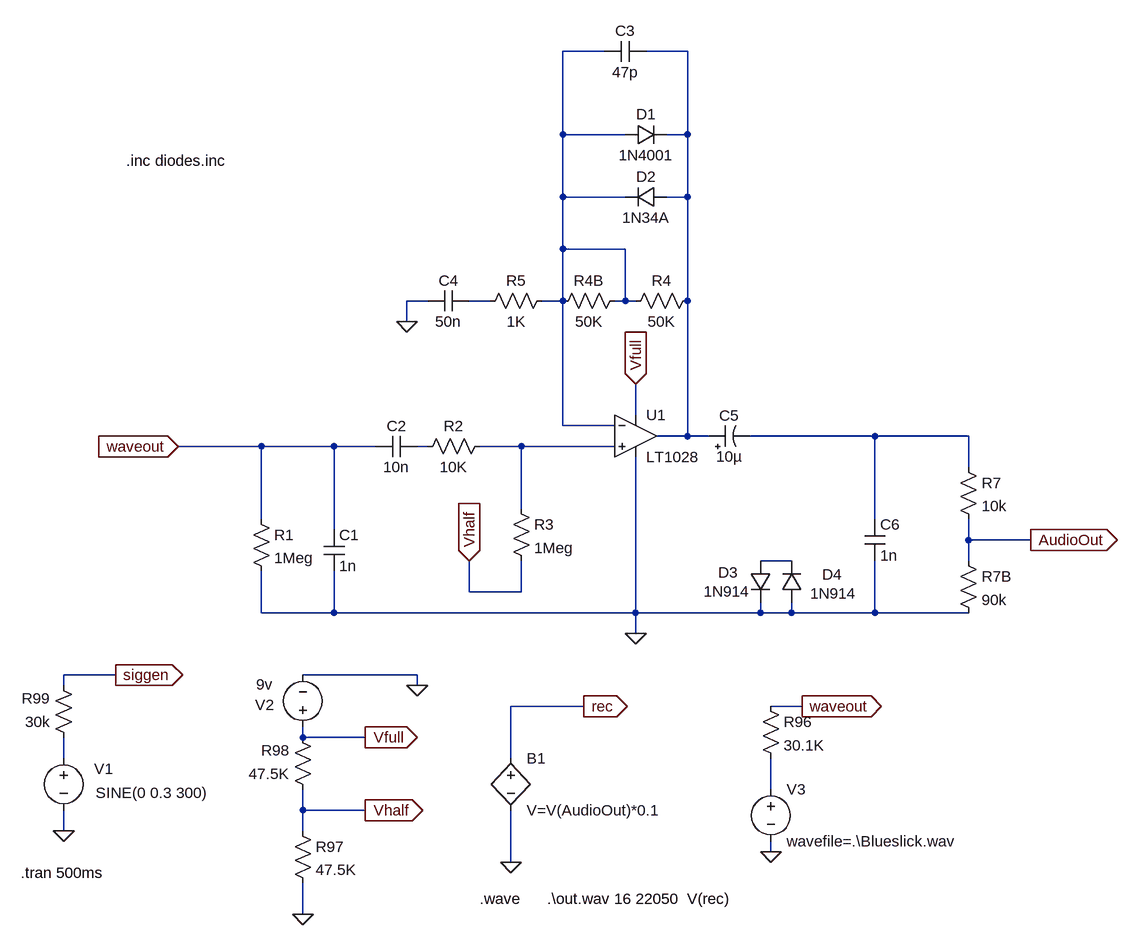
[diagram p0: schematic CYO Distortion.asc]
CYO Distortion.asc, the LTspice schematic file:
Version 4
SHEET 1 880 680
WIRE -2016 -1104 -2080 -1104
WIRE -1888 -1104 -1952 -1104
WIRE -2080 -976 -2080 -1104
WIRE -1984 -976 -2080 -976
WIRE -1888 -976 -1888 -1104
WIRE -1888 -976 -1920 -976
WIRE -2080 -880 -2080 -976
WIRE -1984 -880 -2080 -880
WIRE -1888 -880 -1888 -976
WIRE -1888 -880 -1920 -880
WIRE -2080 -800 -2080 -880
WIRE -1984 -800 -2080 -800
WIRE -2288 -720 -2320 -720
WIRE -2192 -720 -2224 -720
WIRE -2080 -720 -2080 -800
WIRE -2080 -720 -2112 -720
WIRE -1984 -720 -1984 -800
WIRE -1984 -720 -2000 -720
WIRE -1968 -720 -1984 -720
WIRE -1888 -720 -1888 -880
WIRE -2320 -688 -2320 -720
WIRE -1968 -544 -1968 -592
WIRE -2080 -528 -2080 -720
WIRE -2000 -528 -2080 -528
WIRE -1888 -512 -1888 -720
WIRE -1888 -512 -1936 -512
WIRE -1856 -512 -1888 -512
WIRE -1600 -512 -1792 -512
WIRE -1456 -512 -1600 -512
WIRE -2544 -496 -2672 -496
WIRE -2432 -496 -2544 -496
WIRE -2368 -496 -2432 -496
WIRE -2288 -496 -2304 -496
WIRE -2144 -496 -2208 -496
WIRE -2000 -496 -2144 -496
WIRE -1456 -464 -1456 -512
WIRE -2144 -400 -2144 -496
WIRE -2544 -384 -2544 -496
WIRE -1600 -384 -1600 -512
WIRE -2432 -368 -2432 -496
WIRE -1456 -352 -1456 -384
WIRE -1360 -352 -1456 -352
WIRE -1728 -320 -1776 -320
WIRE -1456 -320 -1456 -352
WIRE -2224 -272 -2224 -320
WIRE -2144 -272 -2144 -320
WIRE -2144 -272 -2224 -272
WIRE -2544 -240 -2544 -304
WIRE -2432 -240 -2432 -304
WIRE -2432 -240 -2544 -240
WIRE -1968 -240 -1968 -480
WIRE -1968 -240 -2432 -240
WIRE -1776 -240 -1776 -256
WIRE -1776 -240 -1968 -240
WIRE -1728 -240 -1728 -256
WIRE -1728 -240 -1776 -240
WIRE -1600 -240 -1600 -320
WIRE -1600 -240 -1728 -240
WIRE -1456 -240 -1600 -240
WIRE -1968 -208 -1968 -240
WIRE -2768 -144 -2848 -144
WIRE -2304 -144 -2480 -144
WIRE -2848 -128 -2848 -144
WIRE -2304 -128 -2304 -144
WIRE -2048 -96 -2160 -96
WIRE -1712 -96 -1760 -96
WIRE -2480 -48 -2480 -64
WIRE -2384 -48 -2480 -48
WIRE -2848 -16 -2848 -48
WIRE -2160 -16 -2160 -96
WIRE -1760 32 -1760 -16
WIRE -2480 64 -2480 32
WIRE -2384 64 -2480 64
WIRE -2848 96 -2848 64
WIRE -2480 96 -2480 64
WIRE -1760 128 -1760 112
WIRE -2160 144 -2160 64
WIRE -2480 224 -2480 176
FLAG -2848 96 0
FLAG -2768 -144 siggen
IOPIN -2768 -144 Out
FLAG -2672 -496 waveout
IOPIN -2672 -496 In
FLAG -1968 -208 0
FLAG -2480 224 0
FLAG -2384 -48 Vfull
IOPIN -2384 -48 Out
FLAG -2384 64 Vhalf
IOPIN -2384 64 Out
FLAG -2224 -320 Vhalf
IOPIN -2224 -320 In
FLAG -1360 -352 AudioOut
IOPIN -1360 -352 Out
FLAG -1968 -592 Vfull
IOPIN -1968 -592 In
FLAG -2320 -688 0
FLAG -2048 -96 rec
IOPIN -2048 -96 Out
FLAG -2160 144 0
FLAG -2304 -128 0
FLAG -1760 128 0
FLAG -1712 -96 waveout
IOPIN -1712 -96 Out
SYMBOL voltage -2848 -32 R0
WINDOW 123 24 132 Left 2
WINDOW 39 0 0 Left 2
WINDOW 3 49 69 Left 2
WINDOW 0 47 32 Left 2
SYMATTR Value SINE(0 0.3 300)
SYMATTR InstName V1
SYMBOL res -2832 -32 R180
WINDOW 0 36 76 Left 2
WINDOW 3 36 40 Left 2
SYMATTR InstName R99
SYMATTR Value 30k
SYMBOL res -2560 -400 R0
SYMATTR InstName R1
SYMATTR Value 1Meg
SYMATTR SpiceLine tol=1 pwr=0.1
SYMBOL cap -2448 -368 R0
SYMATTR InstName C1
SYMATTR Value 1n
SYMBOL cap -2304 -512 R90
WINDOW 0 0 32 VBottom 2
WINDOW 3 32 32 VTop 2
SYMATTR InstName C2
SYMATTR Value 10n
SYMBOL res -2192 -512 R90
WINDOW 0 0 56 VBottom 2
WINDOW 3 32 56 VTop 2
SYMATTR InstName R2
SYMATTR Value 10K
SYMATTR SpiceLine tol=1 pwr=0.1
SYMBOL res -2160 -416 R0
SYMATTR InstName R3
SYMATTR Value 1Meg
SYMATTR SpiceLine tol=1 pwr=0.1
SYMBOL voltage -2480 -48 R180
WINDOW 0 44 50 Left 2
WINDOW 3 46 82 Left 2
WINDOW 123 0 0 Left 2
WINDOW 39 0 0 Left 2
SYMATTR InstName V2
SYMATTR Value 9v
SYMBOL res -2496 80 R0
SYMATTR InstName R97
SYMATTR Value 47.5K
SYMATTR SpiceLine tol=1 pwr=0.1
SYMBOL res -2464 48 R180
WINDOW 0 36 76 Left 2
WINDOW 3 36 40 Left 2
SYMATTR InstName R98
SYMATTR Value 47.5K
SYMATTR SpiceLine tol=1 pwr=0.1
SYMBOL Opamps\\LT1028 -1968 -576 R0
SYMATTR InstName U1
SYMBOL polcap -1856 -496 R270
WINDOW 0 32 32 VTop 2
WINDOW 3 0 32 VBottom 2
SYMATTR InstName C5
SYMATTR Value 10µ
SYMATTR Description Capacitor
SYMATTR Type cap
SYMATTR SpiceLine V=10 Irms=0 Rser=2.5 Lser=0 mfg="AVX" pn="TAJC106M010" type="Tantalum"
SYMBOL diode -1792 -320 R0
WINDOW 0 -49 18 Left 2
WINDOW 3 -71 47 Left 2
SYMATTR InstName D3
SYMATTR Value 1N914
SYMBOL diode -1712 -256 R180
WINDOW 0 -62 43 Left 2
WINDOW 3 -84 14 Left 2
SYMATTR InstName D4
SYMATTR Value 1N914
SYMBOL cap -1616 -384 R0
SYMATTR InstName C6
SYMATTR Value 1n
SYMBOL res -1472 -480 R0
SYMATTR InstName R7
SYMATTR Value 10k
SYMBOL res -1472 -336 R0
SYMATTR InstName R7B
SYMATTR Value 90k
SYMBOL res -1872 -736 R90
WINDOW 0 0 56 VBottom 2
WINDOW 3 32 56 VTop 2
SYMATTR InstName R4
SYMATTR Value 50K
SYMBOL res -1984 -736 R90
WINDOW 0 0 56 VBottom 2
WINDOW 3 32 56 VTop 2
SYMATTR InstName R4B
SYMATTR Value 50K
SYMBOL res -2096 -736 R90
WINDOW 0 0 56 VBottom 2
WINDOW 3 32 56 VTop 2
SYMATTR InstName R5
SYMATTR Value 1K
SYMATTR SpiceLine tol=1 pwr=0.1
SYMBOL cap -2224 -736 R90
WINDOW 0 0 32 VBottom 2
WINDOW 3 32 32 VTop 2
SYMATTR InstName C4
SYMATTR Value 50n
SYMBOL cap -1952 -1120 R90
WINDOW 0 0 32 VBottom 2
WINDOW 3 32 32 VTop 2
SYMATTR InstName C3
SYMATTR Value 47p
SYMBOL diode -1920 -896 R90
WINDOW 0 0 32 VBottom 2
WINDOW 3 32 32 VTop 2
SYMATTR InstName D2
SYMATTR Value 1N34A
SYMBOL diode -1984 -960 R270
WINDOW 0 32 32 VTop 2
WINDOW 3 0 32 VBottom 2
SYMATTR InstName D1
SYMATTR Value 1N4001
SYMBOL bv -2160 -32 R0
SYMATTR InstName B1
SYMATTR Value V=V(AudioOut)*0.1
SYMBOL voltage -1760 16 R0
SYMATTR InstName V3
SYMATTR Value wavefile=.\Blueslick.wav
SYMBOL res -1776 -112 R0
SYMATTR InstName R96
SYMATTR Value 30.1K
SYMATTR SpiceLine tol=1 pwr=0.1
TEXT -2752 -936 Left 2 !.inc diodes.inc
TEXT -2208 200 Left 2 !.wave      .\\out.wav 16 22050  V(rec)
TEXT -2914 160 Left 2 !.tran 500ms

The netlist it stands for:
* CYO Distortion.asc
V1 N008 0 SINE(0 0.3 300)
R99 N008 siggen 30k
R1 waveout 0 1Meg tol=1 pwr=0.1
C1 waveout 0 1n
C2 N005 waveout 10n
R2 N006 N005 10K tol=1 pwr=0.1
R3 N006 Vhalf 1Meg tol=1 pwr=0.1
V2 Vfull 0 9v
R97 Vhalf 0 47.5K tol=1 pwr=0.1
R98 Vhalf Vfull 47.5K tol=1 pwr=0.1
XU1 N006 N001 Vfull 0 N002 LT1028  ; pins In+ In- V+ V- OUT
C5 N002 N004 10µ V=10 Irms=0 Rser=2.5 Lser=0 mfg="AVX" pn="TAJC106M010" type="Tantalum"
D3 N007 0 1N914
D4 0 N007 1N914
C6 N004 0 1n
R7 N004 AudioOut 10k
R7B AudioOut 0 90k
R4 N002 N001 50K
R4B N001 N001 50K
R5 N001 N003 1K tol=1 pwr=0.1
C4 N003 0 50n
C3 N002 N001 47p
D2 N002 N001 1N34A
D1 N001 N002 1N4001
B1 rec 0 V=V(AudioOut)*0.1
V3 N009 0 wavefile=.\Blueslick.wav
R96 waveout N009 30.1K tol=1 pwr=0.1
.model D D
.lib standard.dio
.inc diodes.inc
.wave      .\out.wav 16 22050  V(rec)
.tran 500ms
.lib LTC.lib
.backanno
.end